# EAGLE design DenScript Pixel v1.1 (EAGLE 9.1.0)
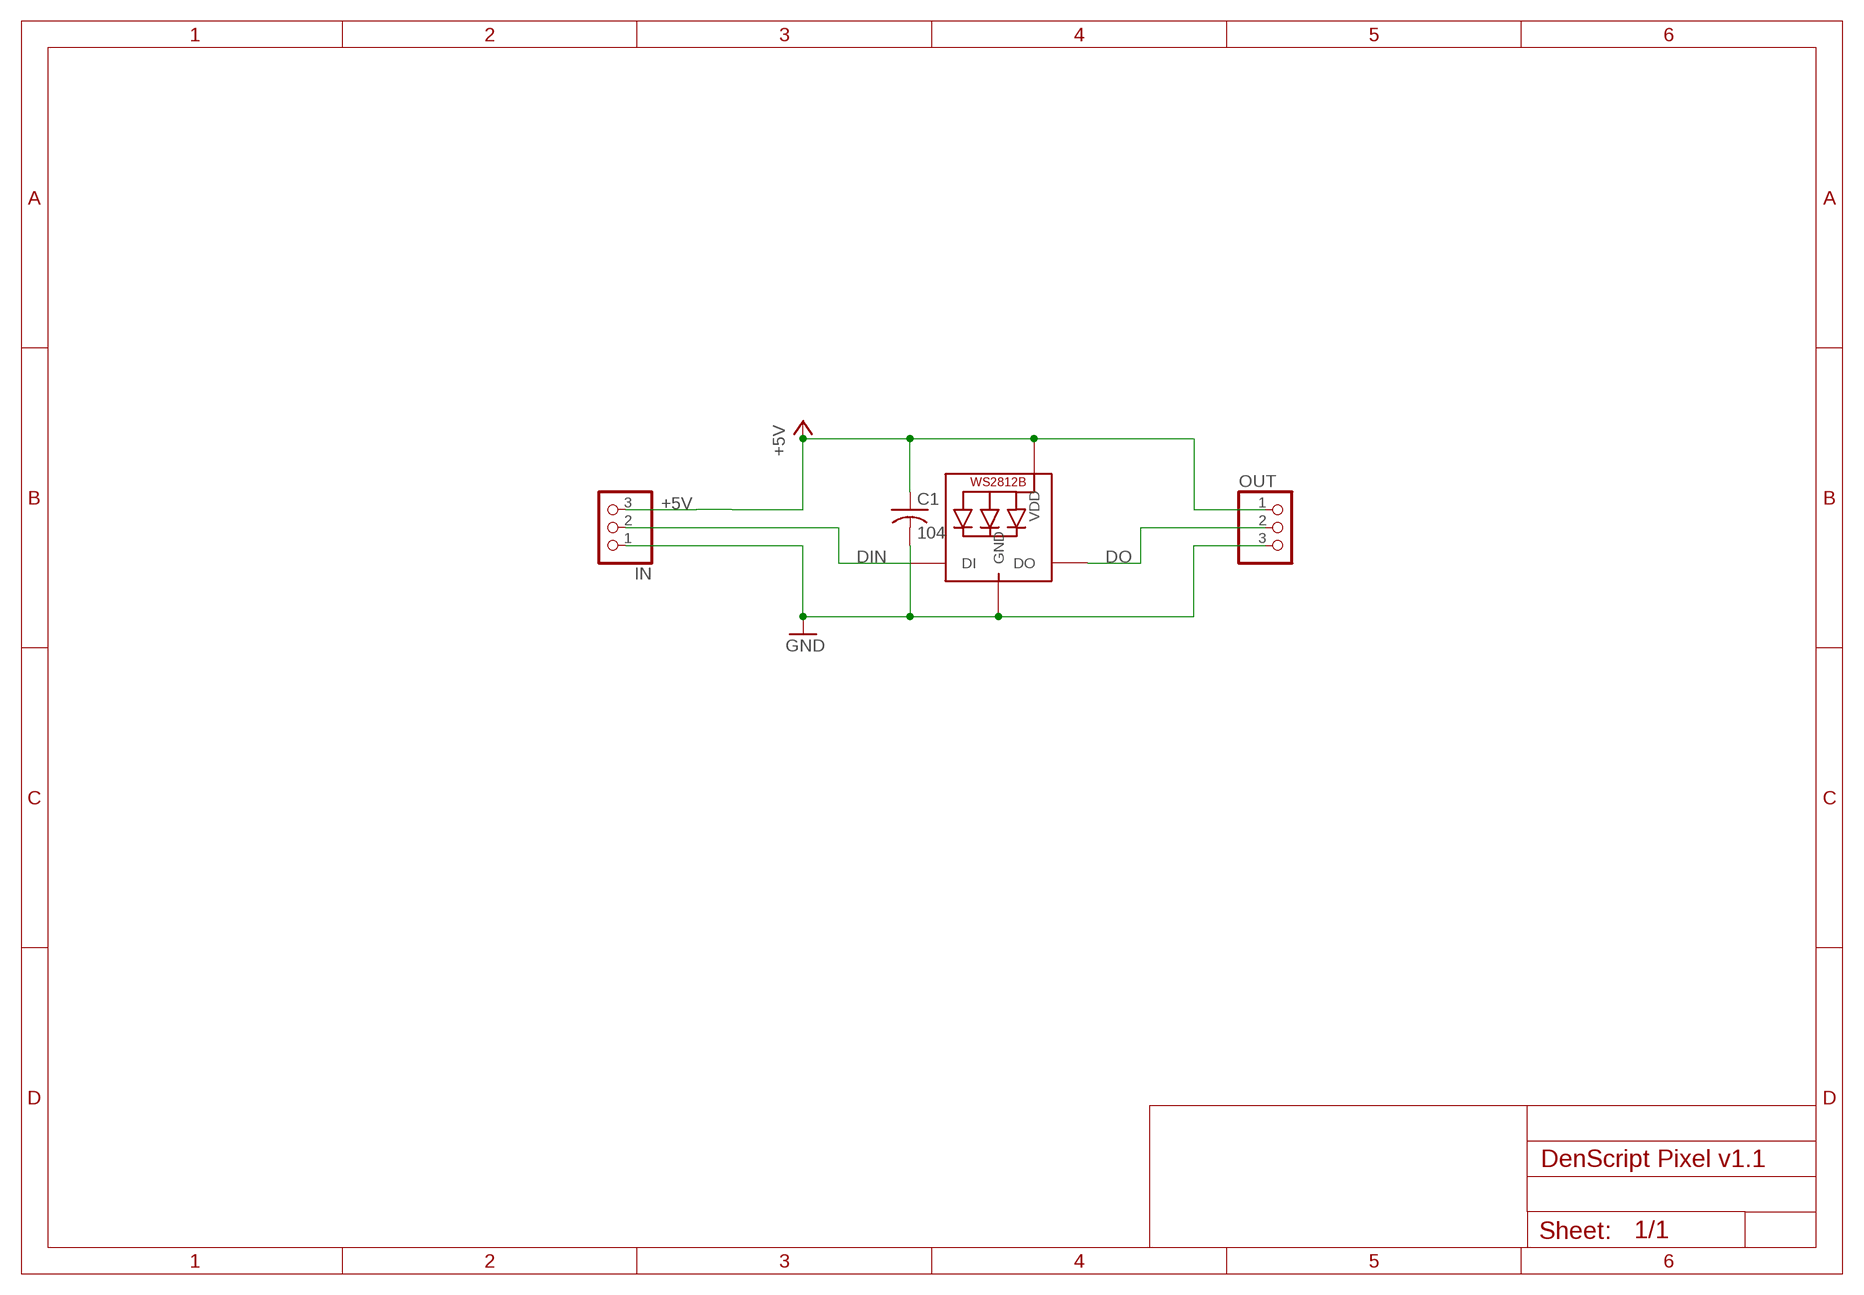
[diagram p0: schematic, sheet 1]

## Parts
C1  104  C-USC0603K  [C0603K]
IN  PINHD-1X3  [1X03]
LED1  WS2812B_5050N  [WS2812B-NARROW]
OUT  PINHD-1X3  [1X03]

## Nets
+5V: C1.1 IN.3 LED1.1-VDD(VDD) OUT.1
DIN: IN.2 LED1.4-DIN(DI)
DO: LED1.2-DOUT(DO) OUT.2
GND: C1.2 IN.1 LED1.3-GND(GND) OUT.3

## Library data of the parts
C1 = adafruit:C-US: CAPACITOR, American symbol
IN OUT = adafruit:PINHD-1X3: PIN HEADER
LED1 = adafruit:WS2812B

## Board
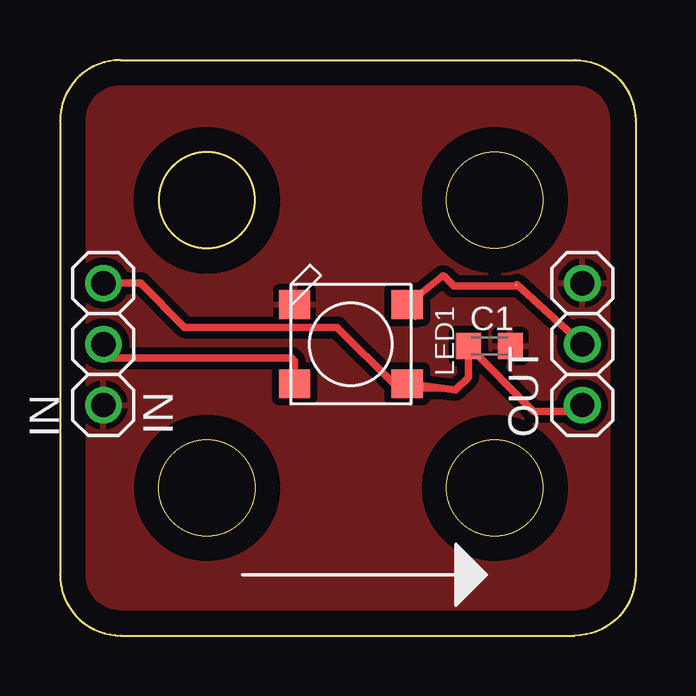
[diagram p1: board, top side]
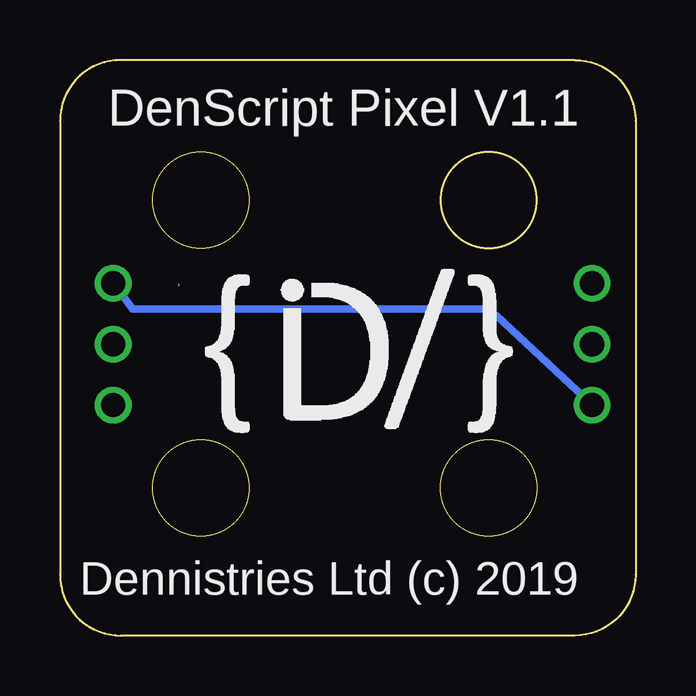
[diagram p2: board, bottom side, seen from below]

Size 24 x 24 mm. Coordinates in mm from the lower left corner, seen from the top.
Outline: 2.54,24 21.46,24 arc-90 24,21.46 24,2.54 arc-90 21.46,0 2.54,0 arc-90 0,2.54 0,21.46 arc-90 2.54,24
Outline: circle at 6.13,18.15 radius 2
Outline: circle at 18.13,18.15 radius 2
Outline: circle at 18.13,6.15 radius 2
Outline: circle at 6.13,6.15 radius 2
Copper layers (1*16): Top 0.035mm / dielectric 1.5mm / Bottom 0.035mm
Design rules "default": minimum track width 6mil, minimum drill 0.35mm, track to track 6mil, track to pad 6mil, pad to pad 6mil, via to via 6mil, smd to smd 6mil, copper to edge 40mil, drill to drill 6mil, minimum pad ring 10mil, minimum via ring 8mil, stop-mask expansion 4mil, vias tented up to drill 0mil, thermal gap 10mil

### Footprints (pad centres in the part's own frame; a part is rotated, then mirrored left to right if it is on the bottom)
C0603K = smd 1.05 x 1.08: 1 -0.875,0; 2 0.875,0
1X03 = drill 1.016: 1 -2.54,0; 2 0,0; 3 2.54,0
WS2812B-NARROW = smd 1.3 x 1.2: 1-VDD 2.35,-1.65; 2-DOUT 2.35,1.65; 3-GND -2.35,1.65; 4-DIN -2.35,-1.65

### Placement (x,y rotation side)
C1  17.9,12.07 0 top
IN  1.81,12.15 90 top
LED1  12.13,12.15 0 top
OUT  21.78,12.15 90 top

### Tracks (layer width: path | path; a pad name or v marks a point on that pad's centre or on a via)
+5V
  Top 0.152: LED1.1-VDD 14.73,10.24 16.5,10.24 | 21.72,9.35 OUT.1
  Top 0.305: 21.72,9.35 19.74,9.35 C1.1 17.02,10.77 16.5,10.24 LED1.1-VDD 13.91,10.5 11.56,12.85 5.21,12.85 3.37,14.69 IN.3
DIN
  Top 0.305: IN.2 2.12,11.58 9.65,11.58 9.78,11.46 LED1.4-DIN
DO  (1 unrouted)
  Top 0.152: 14.82,13.23 LED1.2-DOUT | 15.96,14.99 16,14.99 | 19.02,14.65 19.04,14.63 OUT.2
  Top 0.305: LED1.2-DOUT 15.96,14.99 | 16,14.99 16.42,14.57 19.02,14.57 | 19.04,14.63 OUT.2
GND
  Bottom 0.305: IN.1 5.79,13.34 5.84,13.34 6.12,13.61 20.96,13.61 OUT.3
  pour Top (isolate 0.305): 2.54,23.83 21.44,23.83 arc-90 23.98,21.29 23.98,2.54 arc-90 21.44,0 2.54,0 arc-90 0,2.54 0,21.29 arc-90

### Text on the board
tPlace: IN
bPlace: DenScript Pixel V1.1 | Dennistries Ltd (c) 2019